# Altium schematic sheet Steppers.SchDoc
size A4
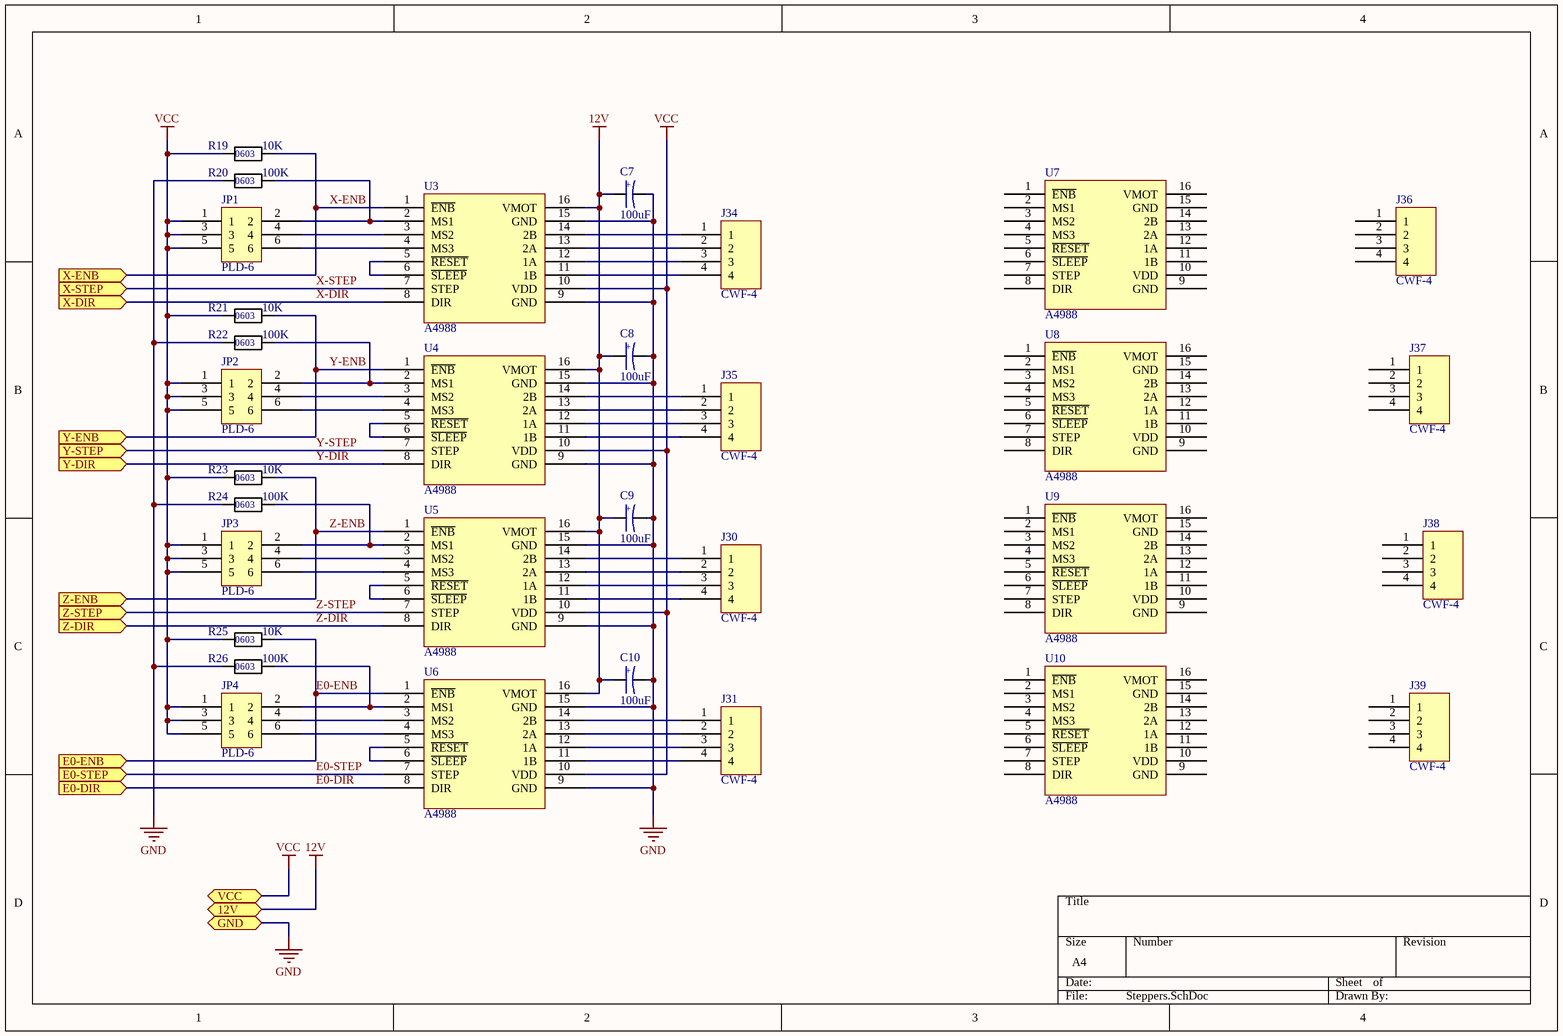
[diagram p0: Steppers.SchDoc]

## Parts
C7  100uF  [Tantal - D]
C8  100uF  [Tantal - D]
C9  100uF  [Tantal - D]
C10  100uF  [Tantal - D]
J30  CWF-4  [CWF-4]
J31  CWF-4  [CWF-4]
J34  CWF-4  [CWF-4]
J35  CWF-4  [CWF-4]
J36  CWF-4  [CWF-4]
J37  CWF-4  [CWF-4]
J38  CWF-4  [CWF-4]
J39  CWF-4  [CWF-4]
JP1  PLD-6  [PLD-6]
JP2  PLD-6  [PLD-6]
JP3  PLD-6  [PLD-6]
JP4  PLD-6  [PLD-6]
R19  10K  [CHIP_R_0603]
R20  100K  [CHIP_R_0603]
R21  10K  [CHIP_R_0603]
R22  100K  [CHIP_R_0603]
R23  10K  [CHIP_R_0603]
R24  100K  [CHIP_R_0603]
R25  10K  [CHIP_R_0603]
R26  100K  [CHIP_R_0603]
U3  A4988  [A4988]
U4  A4988  [A4988]
U5  A4988  [A4988]
U6  A4988  [A4988]
U7  A4988  [A4988]
U8  A4988  [A4988]
U9  A4988  [A4988]
U10  A4988  [A4988]

## Ports
12V, E0-DIR (in), E0-ENB (in), E0-STEP (in), GND, VCC, X-DIR (in), X-ENB (in), X-STEP (in), Y-DIR (in), Y-ENB (in), Y-STEP (in), Z-DIR (in), Z-ENB (in), Z-STEP (in)

## Nets
12V: C7.1 C8.1 C9.1 C10.1 U3.16(VMOT) U4.16(VMOT) U5.16(VMOT) U6.16(VMOT) ; port 12V
GND: C7.2 C8.2 C9.2 C10.2 R20.1 R22.1 R24.1 R26.1 U3.9(GND) U3.15(GND) U4.9(GND) U4.15(GND) U5.9(GND) U5.15(GND) U6.9(GND) U6.15(GND) ; port GND
VCC: JP1.1 JP1.3 JP1.5 JP2.1 JP2.3 JP2.5 JP3.1 JP3.3 JP3.5 JP4.1 JP4.3 JP4.5 R19.1 R21.1 R23.1 R25.1 U3.10(VDD) U4.10(VDD) U5.10(VDD) U6.10(VDD) ; port VCC
E0-DIR: U6.8(DIR) ; port E0-DIR
E0-ENB: R25.2 U6.1(~{ENB}) ; port E0-ENB
E0-STEP: U6.7(STEP) ; port E0-STEP
X-DIR: U3.8(DIR) ; port X-DIR
X-ENB: R19.2 U3.1(~{ENB}) ; port X-ENB
X-STEP: U3.7(STEP) ; port X-STEP
Y-DIR: U4.8(DIR) ; port Y-DIR
Y-ENB: R21.2 U4.1(~{ENB}) ; port Y-ENB
Y-STEP: U4.7(STEP) ; port Y-STEP
Z-DIR: U5.8(DIR) ; port Z-DIR
Z-ENB: R23.2 U5.1(~{ENB}) ; port Z-ENB
Z-STEP: U5.7(STEP) ; port Z-STEP
NetJ30_1: J30.1 U5.14(2B)
NetJ30_2: J30.2 U5.13(2A)
NetJ30_3: J30.3 U5.12(1A)
NetJ30_4: J30.4 U5.11(1B)
NetJ31_1: J31.1 U6.14(2B)
NetJ31_2: J31.2 U6.13(2A)
NetJ31_3: J31.3 U6.12(1A)
NetJ31_4: J31.4 U6.11(1B)
NetJ34_1: J34.1 U3.14(2B)
NetJ34_2: J34.2 U3.13(2A)
NetJ34_3: J34.3 U3.12(1A)
NetJ34_4: J34.4 U3.11(1B)
NetJ35_1: J35.1 U4.14(2B)
NetJ35_2: J35.2 U4.13(2A)
NetJ35_3: J35.3 U4.12(1A)
NetJ35_4: J35.4 U4.11(1B)
NetJP1_2: JP1.2 R20.2 U3.2(MS1)
NetJP1_4: JP1.4 U3.3(MS2)
NetJP1_6: JP1.6 U3.4(MS3)
NetJP2_2: JP2.2 R22.2 U4.2(MS1)
NetJP2_4: JP2.4 U4.3(MS2)
NetJP2_6: JP2.6 U4.4(MS3)
NetJP3_2: JP3.2 R24.2 U5.2(MS1)
NetJP3_4: JP3.4 U5.3(MS2)
NetJP3_6: JP3.6 U5.4(MS3)
NetJP4_2: JP4.2 R26.2 U6.2(MS1)
NetJP4_4: JP4.4 U6.3(MS2)
NetJP4_6: JP4.6 U6.4(MS3)
NetU3_5: U3.5(~{RESET}) U3.6(~{SLEEP})
NetU4_5: U4.5(~{RESET}) U4.6(~{SLEEP})
NetU5_5: U5.5(~{RESET}) U5.6(~{SLEEP})
NetU6_5: U6.5(~{RESET}) U6.6(~{SLEEP})

Not connected (* = marked no-connect by the designer): J36 1 2 3 4; J37 1 2 3 4; J38 1 2 3 4; J39 1 2 3 4; U7 1(~{ENB}) 2(MS1) 3(MS2) 4(MS3) 5(~{RESET}) 6(~{SLEEP}) 7(STEP) 8(DIR) 9(GND) 10(VDD) 11(1B) 12(1A) 13(2A) 14(2B) 15(GND) 16(VMOT); U8 1(~{ENB}) 2(MS1) 3(MS2) 4(MS3) 5(~{RESET}) 6(~{SLEEP}) 7(STEP) 8(DIR) 9(GND) 10(VDD) 11(1B) 12(1A) 13(2A) 14(2B) 15(GND) 16(VMOT); U9 1(~{ENB}) 2(MS1) 3(MS2) 4(MS3) 5(~{RESET}) 6(~{SLEEP}) 7(STEP) 8(DIR) 9(GND) 10(VDD) 11(1B) 12(1A) 13(2A) 14(2B) 15(GND) 16(VMOT); U10 1(~{ENB}) 2(MS1) 3(MS2) 4(MS3) 5(~{RESET}) 6(~{SLEEP}) 7(STEP) 8(DIR) 9(GND) 10(VDD) 11(1B) 12(1A) 13(2A) 14(2B) 15(GND) 16(VMOT)

## Notes on the sheet
- (in symbol RES_0603) 0603
- (in symbol Tantal) +

## Library data of the parts
C7-C10 = Tantal
R19-R26 = RES_0603
U3-U10 = A4988_Carrier